# Altium project Hospital Negatoscop Touch.PrjPcb
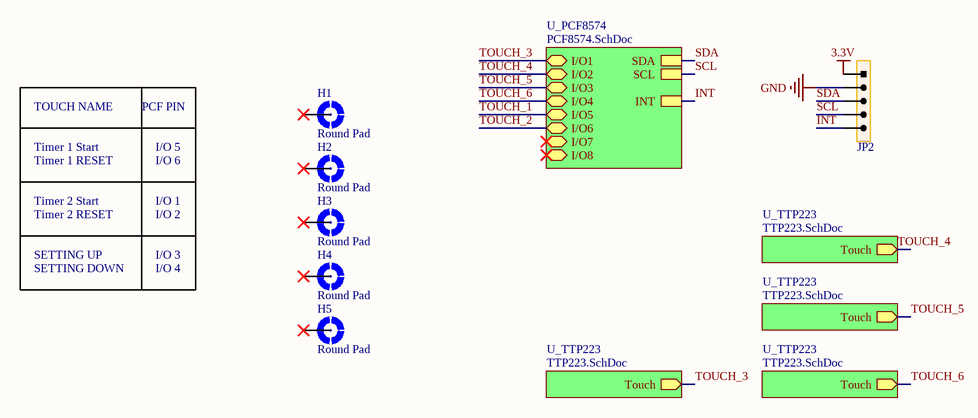
[diagram p0: Main.SchDoc]
3 sheets, 42 parts. Net scope: hierarchical (ports join the sheet entries above them; power ports are global).
Board files: Hospital Negatoscope Touch PCB v1.PcbDoc, Hospital Negatoscope Touch PCB v2 .PcbDoc
Sheets:
  Main.SchDoc
    U_PCF8574 = PCF8574.SchDoc
    U_TTP223 = TTP223.SchDoc
    U_TTP223 = TTP223.SchDoc
    U_TTP223 = TTP223.SchDoc
    U_TTP223 = TTP223.SchDoc

## Sheet Main.SchDoc
size A4; SheetNumber: 1; SheetTotal: 3

### Parts
H1  Round Pad  [P3.2C]  (no BOM)
H2  Round Pad  [P3.2C]  (no BOM)
H3  Round Pad  [P3.2C]  (no BOM)
H4  Round Pad  [P3.2C]  (no BOM)
H5  Round Pad  [P3.2C]  (no BOM)
JP2  HDR-1X5  [XH2.54-5P_H]  (value not drawn)

### Sub-sheets
U_PCF8574 = PCF8574.SchDoc: I/O1 (bidir), I/O2 (bidir), I/O3 (bidir), I/O4 (bidir), I/O5 (bidir), I/O6 (bidir), I/O7 (bidir), I/O8 (bidir), SDA, SCL, INT
U_TTP223 = TTP223.SchDoc: Touch (out)
U_TTP223 = TTP223.SchDoc: Touch (out)
U_TTP223 = TTP223.SchDoc: Touch (out)
U_TTP223 = TTP223.SchDoc: Touch (out)

### Nets
3.3V: JP2.1
GND: JP2.2
SHIELD: H1.P H2.P H3.P H4.P H5.P
INT: JP2.5 ; sheet U_PCF8574/INT
SCL: JP2.4 ; sheet U_PCF8574/SCL
SDA: JP2.3 ; sheet U_PCF8574/SDA
TOUCH_3: sheet U_PCF8574/I/O1, sheet U_TTP223/Touch  [project net OUTPUT]
TOUCH_4: sheet U_PCF8574/I/O2, sheet U_TTP223/Touch  [project net OUTPUT]
TOUCH_5: sheet U_PCF8574/I/O3, sheet U_TTP223/Touch  [project net OUTPUT]
TOUCH_6: sheet U_PCF8574/I/O4, sheet U_TTP223/Touch  [project net OUTPUT]

### Notes on the sheet
- TOUCH NAME
- PCF PIN
- Timer 1 Start
- Timer 1 RESET
- I/O 5
- I/O 6
- Timer 2 Start
- Timer 2 RESET
- I/O 1
- I/O 2
- SETTING UP
- SETTING DOWN
- I/O 3
- I/O 4

### Library data of the parts
H1-H5 = MOUNT-PAD-ROUND: MOUNTING PAD, round
JP2 = Header 5: 5P Connector; BOM名称: 5P接插件; 版权归属: 源创客; 学习资源: www.ooocke.com

## Sheet PCF8574.SchDoc
size A4; SheetNumber: 3; SheetTotal: 3
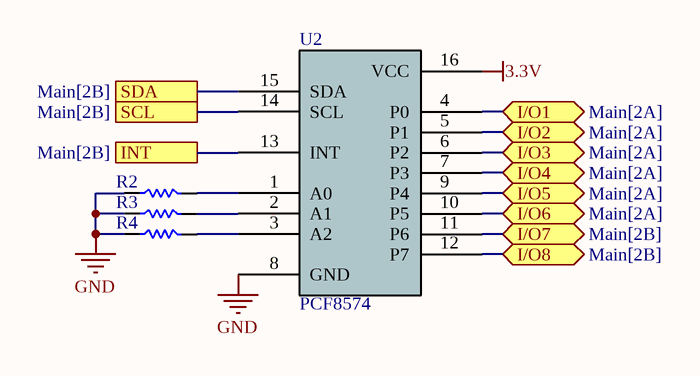
[diagram p1: PCF8574.SchDoc]

### Parts
R2  10K  [R 0805]  (value not drawn)
R3  10K  [R 0805]  (value not drawn)
R4  10K  [R 0805]  (value not drawn)
U2  PCF8574  [SOP16W_M]

### Ports
I/O1 (bidir, see Main[2A]), I/O2 (bidir, see Main[2A]), I/O3 (bidir, see Main[2A]), I/O4 (bidir, see Main[2A]), I/O5 (bidir, see Main[2A]), I/O6 (bidir, see Main[2A]), I/O7 (bidir, see Main[2B]), I/O8 (bidir, see Main[2B]), INT (see Main[2B]), SCL (see Main[2B]), SDA (see Main[2B])

### Nets
3.3V: U2.16(VCC)
GND: R2.1 R3.1 R4.1 U2.8(GND)
INT: U2.13(INT) ; port INT
OUTPUT: U2.4(P0) ; port I/O1
OUTPUT: U2.5(P1) ; port I/O2  [a separate net that carries the same name]
OUTPUT: U2.6(P2) ; port I/O3  [a separate net that carries the same name]
OUTPUT: U2.7(P3) ; port I/O4  [a separate net that carries the same name]
SCL: U2.14(SCL) ; port SCL
SDA: U2.15(SDA) ; port SDA
TOUCH_1: U2.9(P4) ; port I/O5
TOUCH_2: U2.10(P5) ; port I/O6
NetR2_2: R2.2 U2.1(A0)
NetR3_2: R3.2 U2.2(A1)
NetR4_2: R4.2 U2.3(A2)
NetU2_11: U2.11(P6) ; port I/O7
NetU2_12: U2.12(P7) ; port I/O8

### Library data of the parts
R2-R4 = R: Chip resistor; 版权归属: 源创客; BOM名称: Chip resistor; 学习资源: www.ooocke.com
U2 = PCF8574: Remote 8-Bit I/O Expander for I  2C Bus

## Sheet TTP223.SchDoc
size A4; SheetNumber: 2; SheetTotal: 3
Used 4 times, as channels U_TTP223, U_TTP223, U_TTP223, U_TTP223. Parts and nets are listed once, with the designators drawn on the sheet.
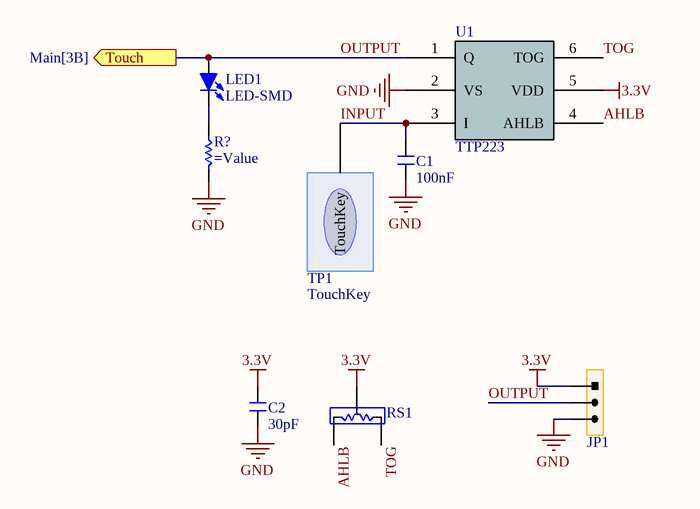
[diagram p2: TTP223.SchDoc]

### Parts
C1  100nF  [C 0805]
C2  30pF  [C 0805]
JP1  HDR-1X3  [HDR-1X3_M]  (value not drawn)
LED1  LED-SMD  [LED 0805G]
R?  (no value)  [R 0805]
RS1  Resistor Selector  [RS 0603]  (value not drawn)
TP1  TouchKey  [Square TouchKey (1.5cm)]
U1  TTP223  [SOT23-6L]

### Ports
Touch (out, see Main[3B])

### Nets
3.3V: C2.1 JP1.1 RS1.3 U1.5(VDD)
GND: C1.2 C2.2 JP1.3 R?.2 U1.2(VS)
AHLB: RS1.2 U1.4(AHLB)
INPUT: C1.1 TP1.1(TouchKey) U1.3(I)
OUTPUT: JP1.2 LED1.1(A) U1.1(Q) ; port Touch
TOG: RS1.1 U1.6(TOG)
NetLED1_2: LED1.2(K) R?.1

### Channels
U_TTP223: designators end in _U_TTP2236; ports Touch=OUTPUT
U_TTP223: designators end in _U_TTP223#1; ports Touch=OUTPUT
U_TTP223: designators end in _U_TTP223#2; ports Touch=OUTPUT
U_TTP223: designators end in _U_TTP2231; ports Touch=OUTPUT

### Library data of the parts
C1 C2 = C: Non-polar patch capacitor; BOM名称: 无极性贴片电容; 版权归属: 源创客; 学习资源: www.ooocke.com
JP1 = Header 3: 3P Connector; BOM名称: 3P接插件; 版权归属: 源创客; 学习资源: www.ooocke.com
LED1 = LED-SMD: Patch LED; BOM名称: 贴片LED; 版权归属: 源创客; 学习资源: www.ooocke.com
R? = R: Chip resistor; 版权归属: 源创客; BOM名称: Chip resistor; 学习资源: www.ooocke.com

## Nets that join several sheets
3.3V: Main (JP2.1), PCF8574 (U2.16), U_TTP223 (C2_U_TTP2236.1 JP1_U_TTP2236.1 RS1_U_TTP2236.3 U1_U_TTP2236.5), U_TTP223 (C2_U_TTP223#1.1 JP1_U_TTP223#1.1 RS1_U_TTP223#1.3 U1_U_TTP223#1.5), U_TTP223 (C2_U_TTP223#2.1 JP1_U_TTP223#2.1 RS1_U_TTP223#2.3 U1_U_TTP223#2.5), U_TTP223 (C2_U_TTP2231.1 JP1_U_TTP2231.1 RS1_U_TTP2231.3 U1_U_TTP2231.5)
GND: Main (JP2.2), PCF8574 (R2.1 R3.1 R4.1 U2.8), U_TTP223 (5 pins), U_TTP223 (5 pins), U_TTP223 (5 pins), U_TTP223 (5 pins)
INT: Main (JP2.5), PCF8574 (U2.13)
OUTPUT: PCF8574 (U2.4), U_TTP223 (JP1_U_TTP2236.2 LED1_U_TTP2236.1 U1_U_TTP2236.1)
OUTPUT: PCF8574 (U2.5), U_TTP223 (JP1_U_TTP223#1.2 LED1_U_TTP223#1.1 U1_U_TTP223#1.1)
OUTPUT: PCF8574 (U2.6), U_TTP223 (JP1_U_TTP223#2.2 LED1_U_TTP223#2.1 U1_U_TTP223#2.1)
OUTPUT: PCF8574 (U2.7), U_TTP223 (JP1_U_TTP2231.2 LED1_U_TTP2231.1 U1_U_TTP2231.1)
SCL: Main (JP2.4), PCF8574 (U2.14)
SDA: Main (JP2.3), PCF8574 (U2.15)